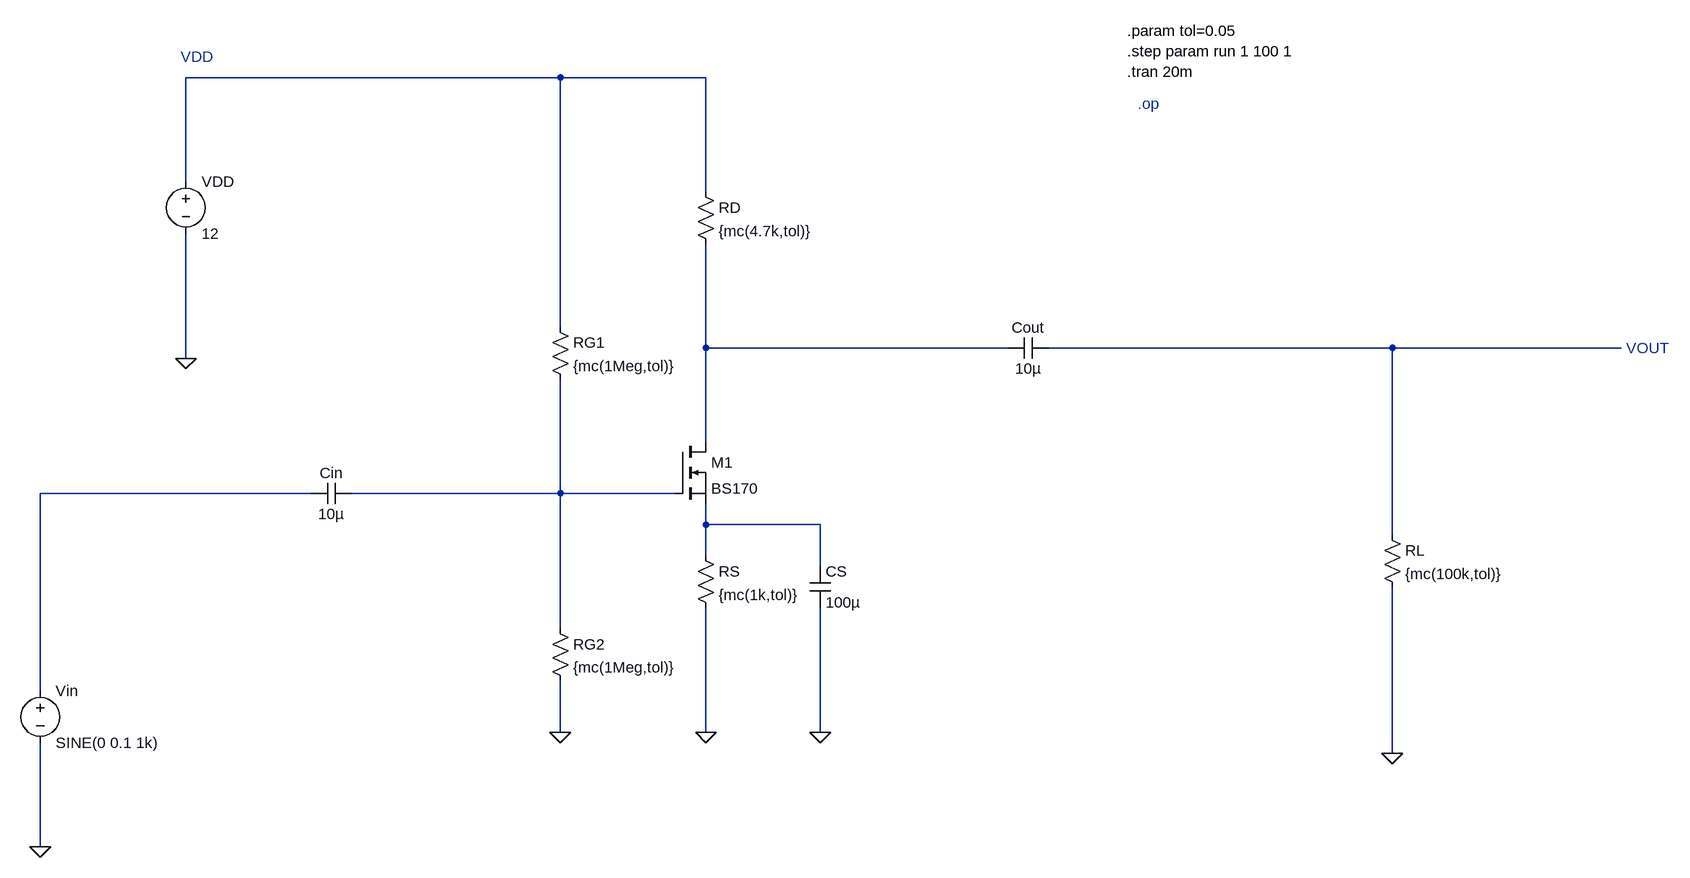
[diagram p0: schematic commonSourceAmplifier.asc]
commonSourceAmplifier.asc, the LTspice schematic file:
Version 4.1
SHEET 1 2044 1044
WIRE 256 -160 -320 -160
WIRE 480 -160 256 -160
WIRE -320 0 -320 -160
WIRE 480 16 480 -160
WIRE 256 224 256 -160
WIRE 480 256 480 96
WIRE 944 256 480 256
WIRE 1536 256 1008 256
WIRE 1888 256 1536 256
WIRE -320 272 -320 80
WIRE 480 400 480 256
WIRE -128 480 -544 480
WIRE 256 480 256 304
WIRE 256 480 -64 480
WIRE 432 480 256 480
WIRE 480 528 480 496
WIRE 656 528 480 528
WIRE 1536 544 1536 256
WIRE 480 576 480 528
WIRE 656 592 656 528
WIRE 256 688 256 480
WIRE -544 784 -544 480
WIRE 256 848 256 768
WIRE 480 848 480 656
WIRE 656 848 656 656
WIRE 1536 880 1536 624
WIRE -544 1024 -544 864
FLAG 1536 880 0
FLAG 256 848 0
FLAG -544 1024 0
FLAG -320 272 0
FLAG 480 848 0
FLAG 656 848 0
SYMBOL res 240 208 R0
SYMATTR InstName RG1
SYMATTR Value {mc(1Meg,tol)}
SYMBOL res 464 0 R0
SYMATTR InstName RD
SYMATTR Value {mc(4.7k,tol)}
SYMBOL res 464 560 R0
SYMATTR InstName RS
SYMATTR Value {mc(1k,tol)}
SYMBOL res 240 672 R0
SYMATTR InstName RG2
SYMATTR Value {mc(1Meg,tol)}
SYMBOL res 1520 528 R0
SYMATTR InstName RL
SYMATTR Value {mc(100k,tol)}
SYMBOL voltage -320 -16 R0
WINDOW 123 0 0 Left 0
WINDOW 39 0 0 Left 0
SYMATTR InstName VDD
SYMATTR Value 12
SYMBOL cap -64 464 R90
WINDOW 0 0 32 VBottom 2
WINDOW 3 32 32 VTop 2
SYMATTR InstName Cin
SYMATTR Value 10µ
SYMBOL cap 1008 240 R90
WINDOW 0 0 32 VBottom 2
WINDOW 3 32 32 VTop 2
SYMATTR InstName Cout
SYMATTR Value 10µ
SYMBOL voltage -544 768 R0
WINDOW 123 0 0 Left 0
WINDOW 39 0 0 Left 0
SYMATTR InstName Vin
SYMATTR Value SINE(0 0.1 1k)
SYMBOL nmos 432 400 R0
SYMATTR InstName M1
SYMATTR Value BS170
SYMBOL cap 640 592 R0
SYMATTR InstName CS
SYMATTR Value 100µ
TEXT 1896 256 Left 2 ;VOUT
TEXT -328 -192 Left 2 ;VDD
TEXT 1128 -232 Left 2 !.param tol=0.05\n.step param run 1 100 1\n.tran 20m
TEXT 1144 -120 Left 2 ;.op

The netlist it stands for:
* commonSourceAmplifier.asc
RG1 N001 N005 {mc(1Meg,tol)}
RD N001 N002 {mc(4.7k,tol)}
RS N006 0 {mc(1k,tol)}
RG2 N005 0 {mc(1Meg,tol)}
RL N003 0 {mc(100k,tol)}
VDD N001 0 12
Cin N005 N004 10µ
Cout N003 N002 10µ
Vin N004 0 SINE(0 0.1 1k)
M1 N002 N005 N006 N006 BS170
CS N006 0 100µ
.model NMOS NMOS
.model PMOS PMOS
.lib standard.mos
* VOUT
* VDD
.param tol=0.05
.step param run 1 100 1
.tran 20m
* .op
.backanno
.end